# Altium schematic sheet BUS.SchDoc
size A4
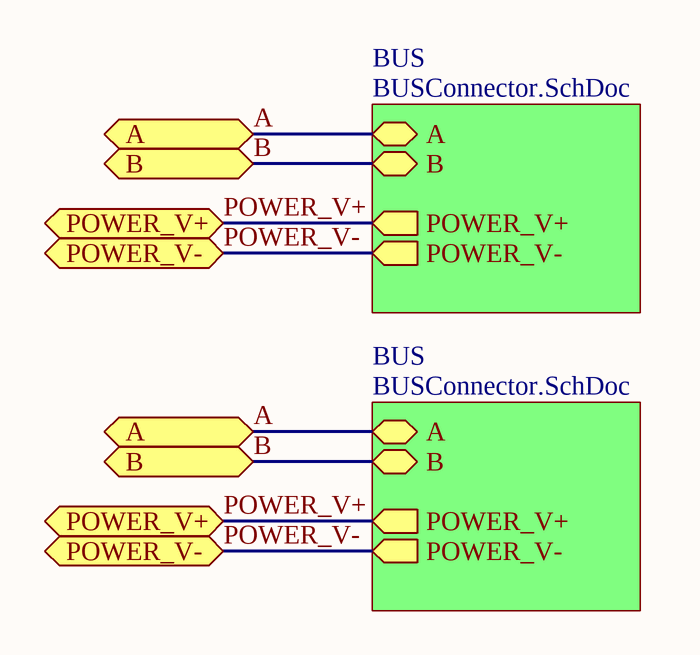
[diagram p0: BUS.SchDoc]

## Sub-sheets
BUS = BUSConnector.SchDoc: A (bidir), B (bidir), POWER_V+ (out), POWER_V- (out)
BUS = BUSConnector.SchDoc: A (bidir), B (bidir), POWER_V+ (out), POWER_V- (out)

## Ports
A, B, POWER_V+, POWER_V-

## Nets
A: port A, sheet BUS/A, sheet BUS/A
B: port B, sheet BUS/B, sheet BUS/B
POWER_V+: port POWER_V+, sheet BUS/POWER_V+, sheet BUS/POWER_V+
POWER_V-: port POWER_V-, sheet BUS/POWER_V-, sheet BUS/POWER_V-